# EAGLE schematic doska-digital (EAGLE 6.2)
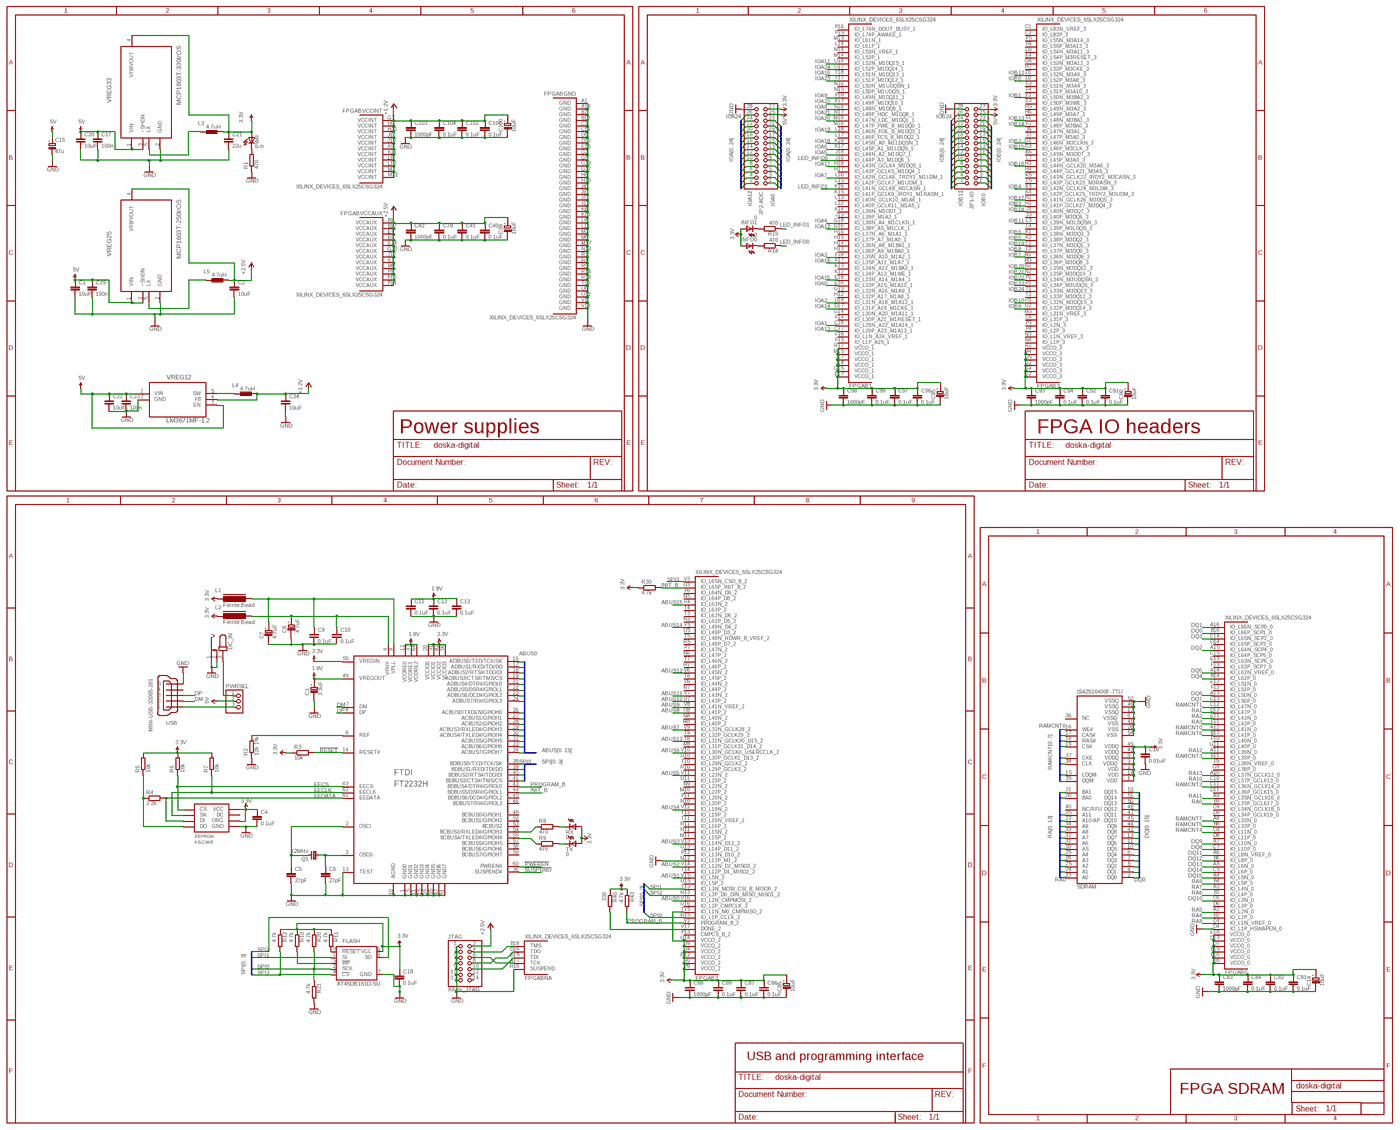
[diagram p0: schematic, sheet 1, overview]
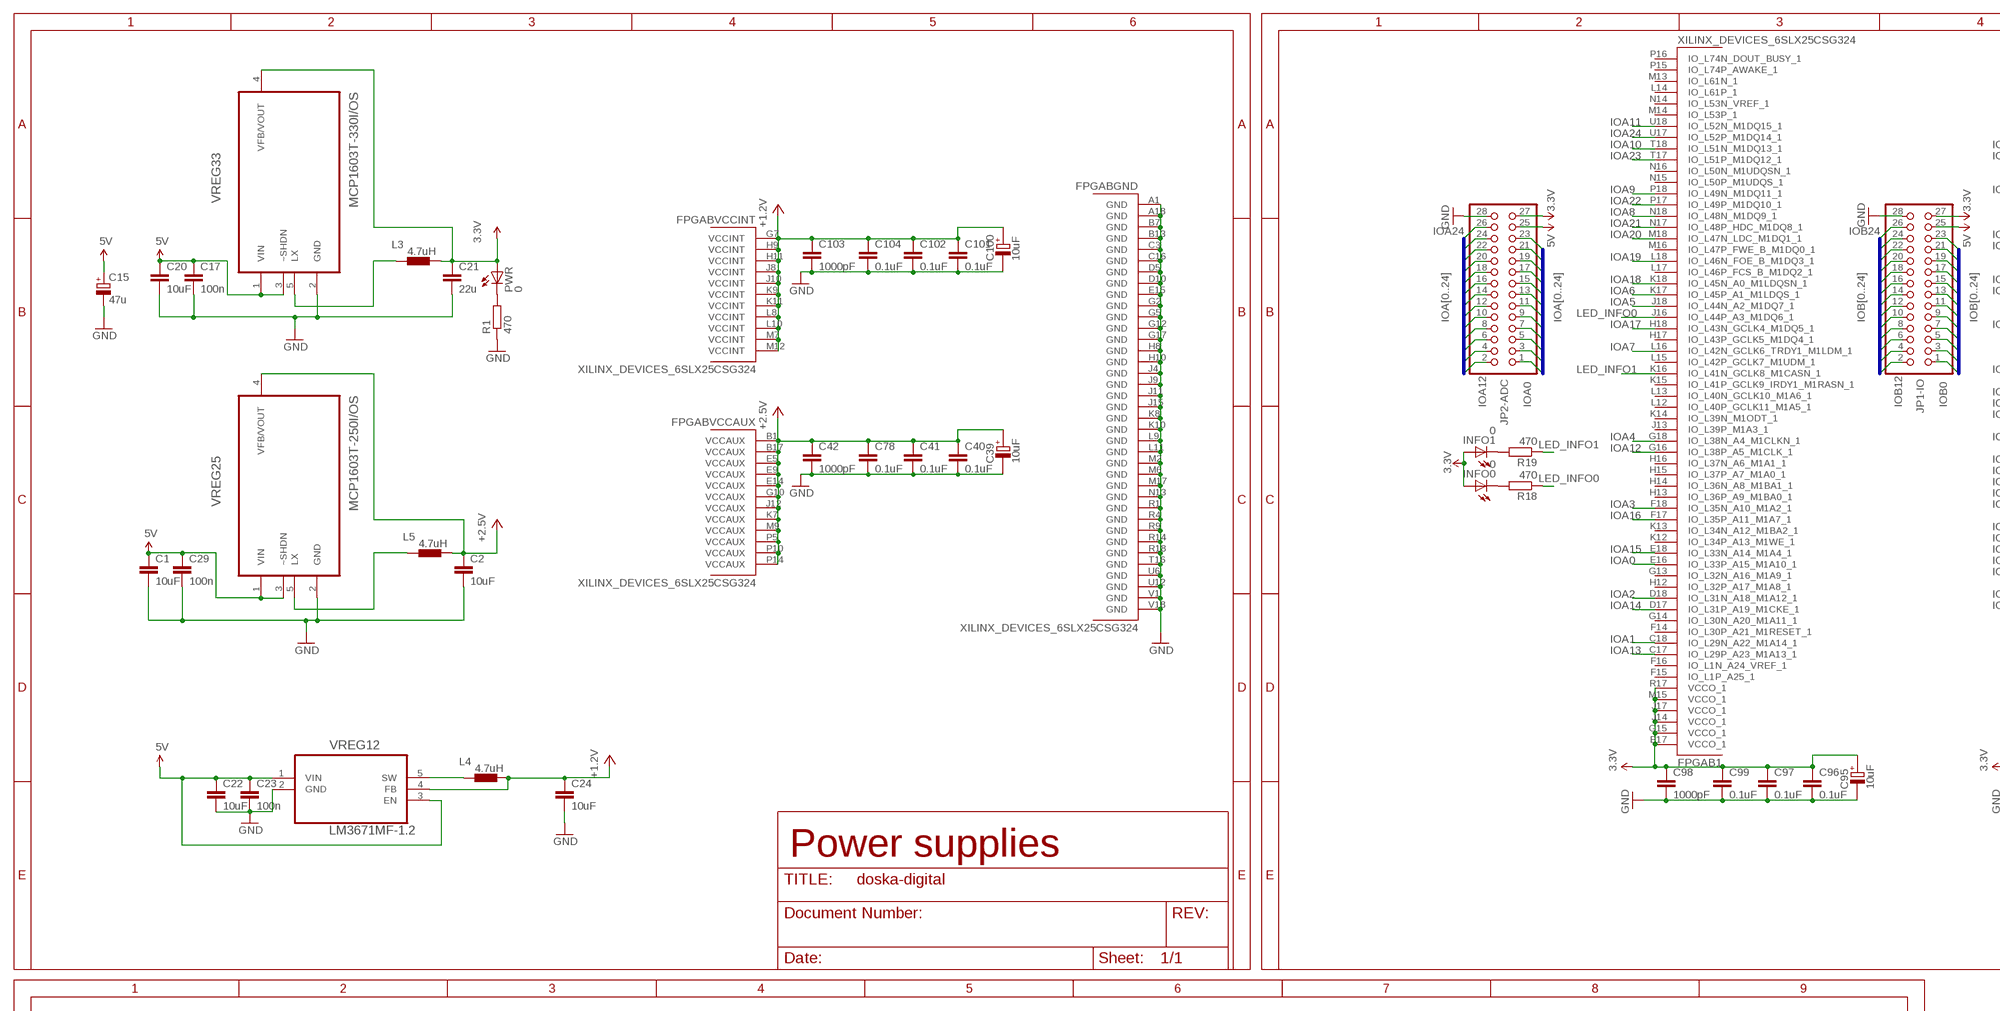
[diagram p1: schematic, sheet 1, part 1 of 4]
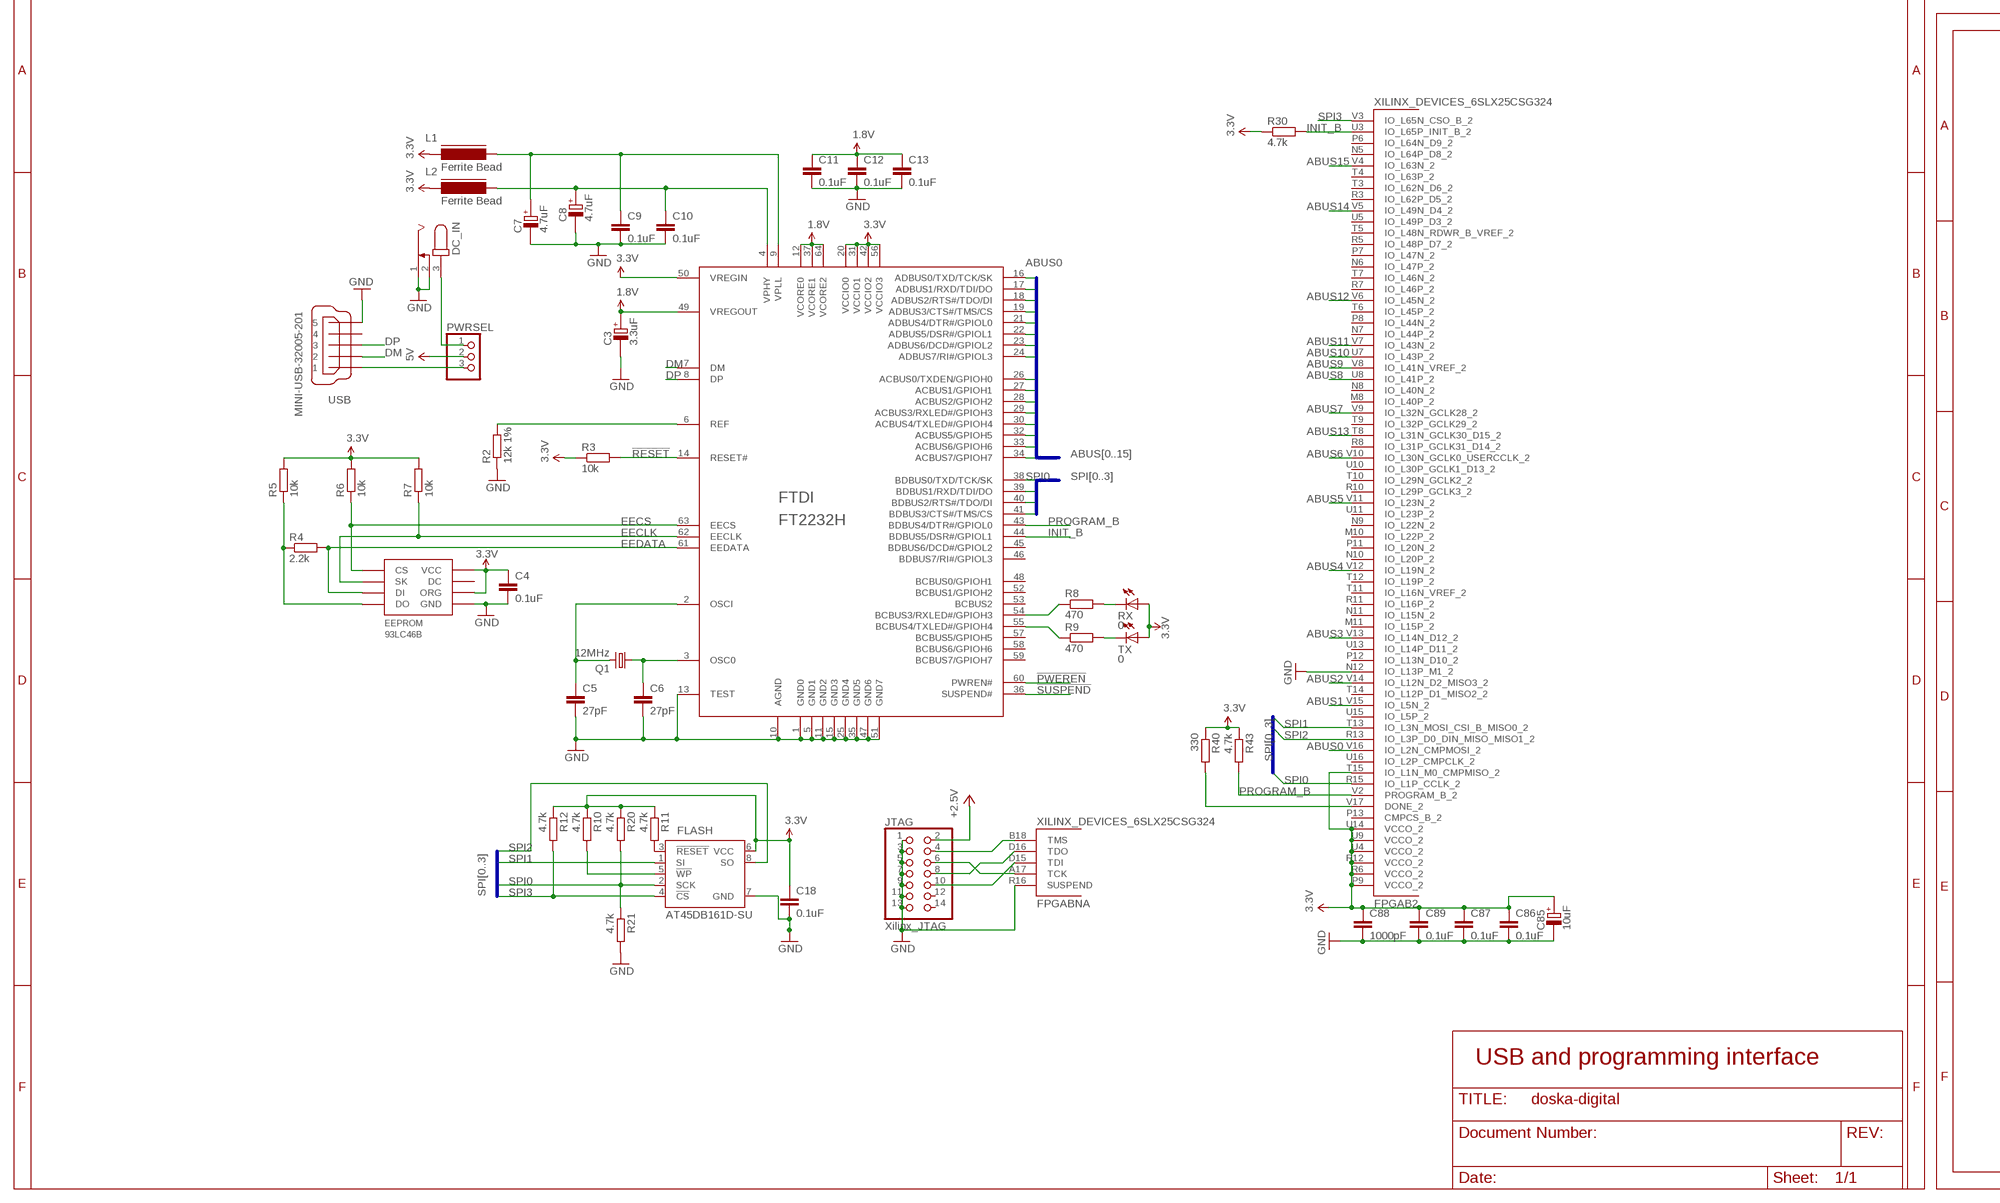
[diagram p2: schematic, sheet 1, part 2 of 4]
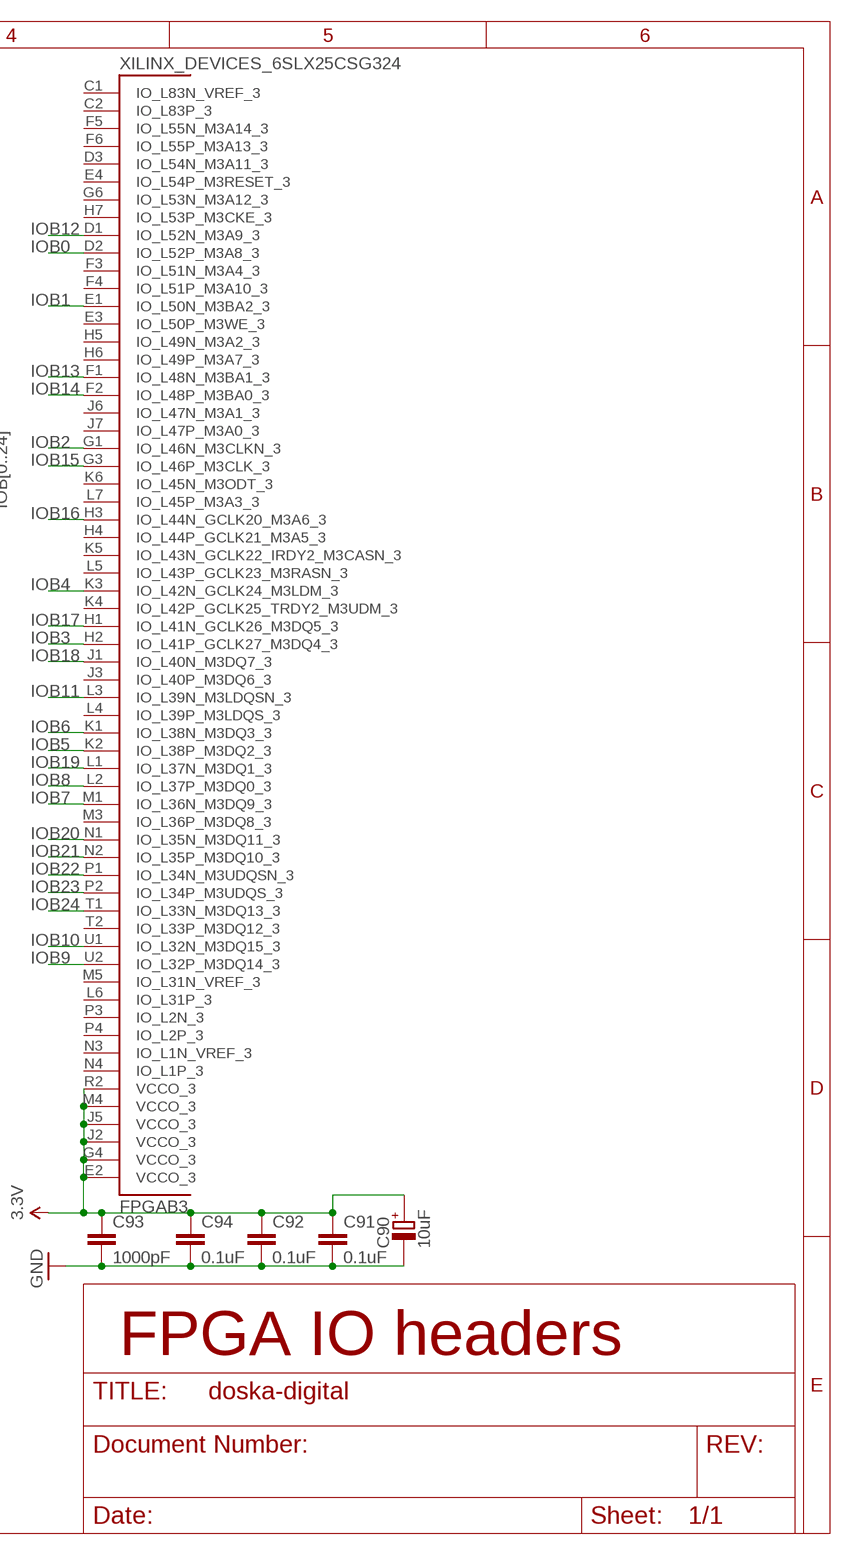
[diagram p3: schematic, sheet 1, part 3 of 4]
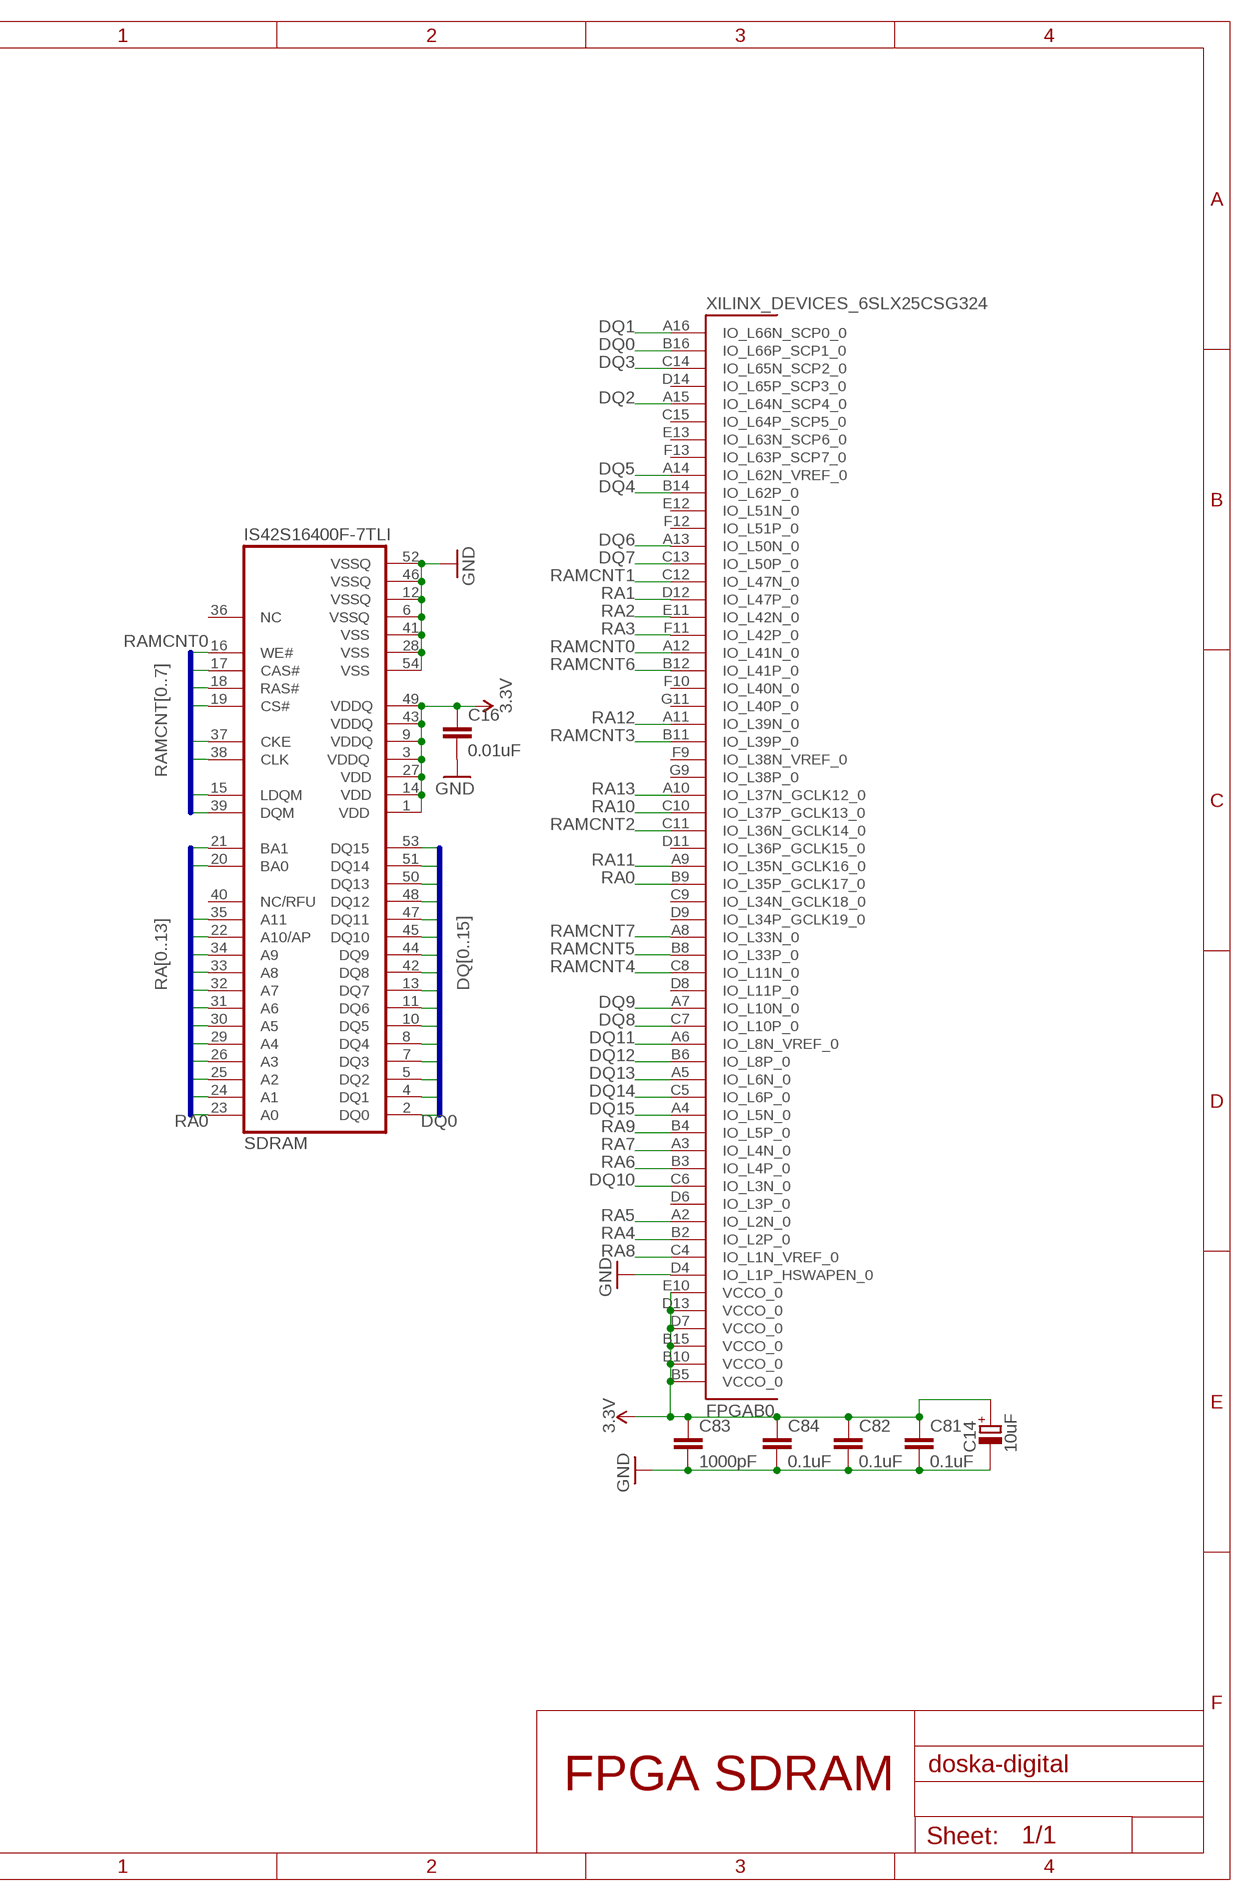
[diagram p4: schematic, sheet 1, part 4 of 4]

## Parts
C1  10uF  CAPC805  [C805]
C2  10uF  CAPC805  [C805]
C3  3.3uF  POLARISED_A_CASE  [CAPMP3216X180N]
C4  0.1uF  CAPC805  [C805]
C5  27pF  CAPC805  [C805]
C6  27pF  CAPC805  [C805]
C7  4.7uF  POLARISED_A_CASE  [CAPMP3216X180N]
C8  4.7uF  POLARISED_A_CASE  [CAPMP3216X180N]
C9  0.1uF  CAPC603  [C603]
C10  0.1uF  CAPC603  [C603]
C11  0.1uF  CAPC603  [C603]
C12  0.1uF  CAPC603  [C603]
C13  0.1uF  CAPC805  [C805]
C14  10uF  POLARISED_A_CASE  [CAPMP3216X180N]
C15  47u  RCL_CPOL-EUE2-5  [RCL_E2-5]
C16  0.01uF  CAPC805  [C805]
C17  100n  CAPC805  [C805]
C18  0.1uF  CAPC805  [C805]
C20  10uF  CAPC805  [C805]
C21  22u  CAPC805  [C805]
C22  10uF  CAPC805  [C805]
C23  100n  CAPC805  [C805]
C24  10uF  CAPC805  [C805]
C29  100n  CAPC805  [C805]
C39  10uF  POLARISED_A_CASE  [CAPMP3216X180N]
C40  0.1uF  CAPC603  [C603]
C41  0.1uF  CAPC603  [C603]
C42  1000pF  CAPC603  [C603]
C78  0.1uF  CAPC603  [C603]
C81  0.1uF  CAPC603  [C603]
C82  0.1uF  CAPC603  [C603]
C83  1000pF  CAPC603  [C603]
C84  0.1uF  CAPC603  [C603]
C85  10uF  POLARISED_A_CASE  [CAPMP3216X180N]
C86  0.1uF  CAPC603  [C603]
C87  0.1uF  CAPC603  [C603]
C88  1000pF  CAPC603  [C603]
C89  0.1uF  CAPC603  [C603]
C90  10uF  POLARISED_A_CASE  [CAPMP3216X180N]
C91  0.1uF  CAPC603  [C603]
C92  0.1uF  CAPC603  [C603]
C93  1000pF  CAPC603  [C603]
C94  0.1uF  CAPC603  [C603]
C95  10uF  POLARISED_A_CASE  [CAPMP3216X180N]
C96  0.1uF  CAPC603  [C603]
C97  0.1uF  CAPC603  [C603]
C98  1000pF  CAPC603  [C603]
C99  0.1uF  CAPC603  [C603]
C100  10uF  POLARISED_A_CASE  [CAPMP3216X180N]
C101  0.1uF  CAPC603  [C603]
C102  0.1uF  CAPC603  [C603]
C103  1000pF  CAPC603  [C603]
C104  0.1uF  CAPC603  [C603]
DC_IN  CON-JACK_JACK-PLUG1  [CON-JACK_SPC4078]
EEPROM  93LC46B  93C46  [SOIC8]
FLASH  AT45DB161D-SU  [8S2]
FPGA  XILINX_DEVICES_6SLX25CSG324  [XILINX_DEVICES_CS324]
FTDI  FT2232H  [LQFP64]
INFO0  0  LEDCHIPLED_1206  [CHIPLED_1206]
INFO1  0  LEDCHIPLED_1206  [CHIPLED_1206]
JP1-IO  PINHEAD_PINHD-2X14  [PINHEAD_2X14]
JP2-ADC  PINHEAD_PINHD-2X14  [PINHEAD_2X14]
JTAG  Xilinx_JTAG  PINHEAD_PINHD-2X7  [PINHEAD_2X07]
L1  Ferrite Bead  FERRITE_BEAD805  [FB805]
L2  Ferrite Bead  FERRITE_BEAD805  [FB805]
L3  4.7uH  SMT43-4R7K  [SMT43]
L4  4.7uH  SMT43-4R7K  [SMT43]
L5  4.7uH  SMT43-4R7K  [SMT43]
PWR  0  LEDCHIPLED_1206  [CHIPLED_1206]
PWRSEL  PINHEAD_PINHD-1X3  [PINHEAD_1X03]
Q1  12MHz  CRYSTALCTS406  [CTS406]
R1  470  RESISTORR805R805  [R805]
R2  12k 1%  RESISTORR603  [R603]
R3  10k  RESISTORR805R805  [R805]
R4  2.2k  RESISTORR805R805  [R805]
R5  10k  RESISTORR805R805  [R805]
R6  10k  RESISTORR805R805  [R805]
R7  10k  RESISTORR805R805  [R805]
R8  470  RESISTORR805R805  [R805]
R9  470  RESISTORR805R805  [R805]
R10  4.7k  RESISTORR805R805  [R805]
R11  4.7k  RESISTORR805R805  [R805]
R12  4.7k  RESISTORR805R805  [R805]
R18  470  RESISTORR805R805  [R805]
R19  470  RESISTORR805R805  [R805]
R20  4.7k  RESISTORR603  [R603]
R21  4.7k  RESISTORR603  [R603]
R30  4.7k  RESISTORR603  [R603]
R40  330  RESISTORR603  [R603]
R43  4.7k  RESISTORR603  [R603]
RX  0  LEDCHIPLED_1206  [CHIPLED_1206]
SDRAM  IS42S16400F-7TLI  AS4C4M16S-6TAN  [TSOP54]
TX  0  LEDCHIPLED_1206  [CHIPLED_1206]
USB  MINI-USB-32005-201  [32005-201]
VREG12  LM3671MF-1.2  [SOT95P284X122-5N]
VREG25  MCP1603T-250I/OS  [SOT95P280X110-5N]
VREG33  MCP1603T-330I/OS  [SOT95P280X110-5N]

## Nets
1.8V: C3.+ C11.1 C12.1 C13.1 FTDI.12(VCORE0) FTDI.37(VCORE1) FTDI.49(VREGOUT) FTDI.64(VCORE2)
3.3V: C4.1 C14.+ C16.1 C18.1 C21.1 C81.1 C82.1 C83.1 C84.1 C85.+ C86.1 C87.1 C88.1 C89.1 C90.+ C91.1 C92.1 C93.1 C94.1 C95.+ C96.1 C97.1 C98.1 C99.1 EEPROM.6(ORG) EEPROM.8(VCC) FLASH.6(VCC) FPGA.B5(B0:VCCO_0) FPGA.B10(B0:VCCO_0) FPGA.B15(B0:VCCO_0) FPGA.D7(B0:VCCO_0) FPGA.D13(B0:VCCO_0) FPGA.E2(B3:VCCO_3) FPGA.E10(B0:VCCO_0) FPGA.E17(B1:VCCO_1) FPGA.G4(B3:VCCO_3) FPGA.G15(B1:VCCO_1) FPGA.J2(B3:VCCO_3) FPGA.J5(B3:VCCO_3) FPGA.J14(B1:VCCO_1) FPGA.J17(B1:VCCO_1) FPGA.M4(B3:VCCO_3) FPGA.M15(B1:VCCO_1) FPGA.P9(B2:VCCO_2) FPGA.R2(B3:VCCO_3) FPGA.R6(B2:VCCO_2) FPGA.R12(B2:VCCO_2) FPGA.R17(B1:VCCO_1) FPGA.T15(B2:IO_L1N_M0_CMPMISO_2) FPGA.U4(B2:VCCO_2) FPGA.U9(B2:VCCO_2) FPGA.U14(B2:VCCO_2) FTDI.20(VCCIO0) FTDI.31(VCCIO1) FTDI.42(VCCIO2) FTDI.50(VREGIN) FTDI.56(VCCIO3) INFO0.A INFO1.A JP1-IO.27 JP2-ADC.27 L1.2 L2.2 L3.P$1 PWR.A R3.1 R5.2 R6.2 R7.2 R10.1 R11.1 R12.1 R20.1 R30.1 R40.1 R43.1 RX.A SDRAM.1(VDD) SDRAM.3(VDDQ) SDRAM.9(VDDQ) SDRAM.14(VDD) SDRAM.27(VDD) SDRAM.43(VDDQ) SDRAM.49(VDDQ) TX.A VREG33.4(VFB/VOUT)
5V: C1.1 C15.+ C17.1 C20.1 C22.1 C23.1 C29.1 JP1-IO.25 JP2-ADC.25 PWRSEL.2 VREG12.1(VIN) VREG12.3(EN) VREG25.1(VIN) VREG25.3(~SHDN) VREG33.1(VIN) VREG33.3(~SHDN)
!PWEREN: FTDI.60(PWREN#)
!RESET: FTDI.14(RESET#) R3.2
!SUSPEND: FTDI.36(SUSPEND#)
+1.2V: C24.1 C100.+ C101.1 C102.1 C103.1 C104.1 FPGA.G7(BVCCINT:VCCINT) FPGA.H9(BVCCINT:VCCINT) FPGA.H11(BVCCINT:VCCINT) FPGA.J8(BVCCINT:VCCINT) FPGA.J10(BVCCINT:VCCINT) FPGA.K9(BVCCINT:VCCINT) FPGA.K11(BVCCINT:VCCINT) FPGA.L8(BVCCINT:VCCINT) FPGA.L10(BVCCINT:VCCINT) FPGA.M7(BVCCINT:VCCINT) FPGA.M12(BVCCINT:VCCINT) L4.P$1 VREG12.4(FB)
+2.5V: C2.1 C39.+ C40.1 C41.1 C42.1 C78.1 FPGA.B1(BVCCAUX:VCCAUX) FPGA.B17(BVCCAUX:VCCAUX) FPGA.E5(BVCCAUX:VCCAUX) FPGA.E9(BVCCAUX:VCCAUX) FPGA.E14(BVCCAUX:VCCAUX) FPGA.G10(BVCCAUX:VCCAUX) FPGA.J12(BVCCAUX:VCCAUX) FPGA.K7(BVCCAUX:VCCAUX) FPGA.M9(BVCCAUX:VCCAUX) FPGA.P5(BVCCAUX:VCCAUX) FPGA.P10(BVCCAUX:VCCAUX) FPGA.P14(BVCCAUX:VCCAUX) JTAG.2 L5.P$1 VREG25.4(VFB/VOUT)
ABUS0: FPGA.V16(B2:IO_L2N_CMPMOSI_2) FTDI.16(ADBUS0/TXD/TCK/SK)
ABUS1: FPGA.V15(B2:IO_L5N_2) FTDI.17(ADBUS1/RXD/TDI/DO)
ABUS2: FPGA.V14(B2:IO_L12N_D2_MISO3_2) FTDI.18(ADBUS2/RTS#/TDO/DI)
ABUS3: FPGA.V13(B2:IO_L14N_D12_2) FTDI.19(ADBUS3/CTS#/TMS/CS)
ABUS4: FPGA.V12(B2:IO_L19N_2) FTDI.21(ADBUS4/DTR#/GPIOL0)
ABUS5: FPGA.V11(B2:IO_L23N_2) FTDI.22(ADBUS5/DSR#/GPIOL1)
ABUS6: FPGA.V10(B2:IO_L30N_GCLK0_USERCCLK_2) FTDI.23(ADBUS6/DCD#/GPIOL2)
ABUS7: FPGA.V9(B2:IO_L32N_GCLK28_2) FTDI.24(ADBUS7/RI#/GPIOL3)
ABUS8: FPGA.U8(B2:IO_L41P_2) FTDI.26(ACBUS0/TXDEN/GPIOH0)
ABUS9: FPGA.V8(B2:IO_L41N_VREF_2) FTDI.27(ACBUS1/GPIOH1)
ABUS10: FPGA.U7(B2:IO_L43P_2) FTDI.28(ACBUS2/GPIOH2)
ABUS11: FPGA.V7(B2:IO_L43N_2) FTDI.29(ACBUS3/RXLED#/GPIOH3)
ABUS12: FPGA.V6(B2:IO_L45N_2) FTDI.30(ACBUS4/TXLED#/GPIOH4)
ABUS13: FPGA.T8(B2:IO_L31N_GCLK30_D15_2) FTDI.32(ACBUS5/GPIOH5)
ABUS14: FPGA.V5(B2:IO_L49N_D4_2) FTDI.33(ACBUS6/GPIOH6)
ABUS15: FPGA.V4(B2:IO_L63N_2) FTDI.34(ACBUS7/GPIOH7)
DM: FTDI.7(DM) USB.2
DP: FTDI.8(DP) USB.3
DQ0: FPGA.B16(B0:IO_L66P_SCP1_0) SDRAM.2(DQ0)
DQ1: FPGA.A16(B0:IO_L66N_SCP0_0) SDRAM.4(DQ1)
DQ2: FPGA.A15(B0:IO_L64N_SCP4_0) SDRAM.5(DQ2)
DQ3: FPGA.C14(B0:IO_L65N_SCP2_0) SDRAM.7(DQ3)
DQ4: FPGA.B14(B0:IO_L62P_0) SDRAM.8(DQ4)
DQ5: FPGA.A14(B0:IO_L62N_VREF_0) SDRAM.10(DQ5)
DQ6: FPGA.A13(B0:IO_L50N_0) SDRAM.11(DQ6)
DQ7: FPGA.C13(B0:IO_L50P_0) SDRAM.13(DQ7)
DQ8: FPGA.C7(B0:IO_L10P_0) SDRAM.42(DQ8)
DQ9: FPGA.A7(B0:IO_L10N_0) SDRAM.44(DQ9)
DQ10: FPGA.C6(B0:IO_L3N_0) SDRAM.45(DQ10)
DQ11: FPGA.A6(B0:IO_L8N_VREF_0) SDRAM.47(DQ11)
DQ12: FPGA.B6(B0:IO_L8P_0) SDRAM.48(DQ12)
DQ13: FPGA.A5(B0:IO_L6N_0) SDRAM.50(DQ13)
DQ14: FPGA.C5(B0:IO_L6P_0) SDRAM.51(DQ14)
DQ15: FPGA.A4(B0:IO_L5N_0) SDRAM.53(DQ15)
EECLK: EEPROM.2(SK) FTDI.62(EECLK) R7.1
EECS: EEPROM.1(CS) FTDI.63(EECS) R6.1
EEDATA: EEPROM.3(DI) FTDI.61(EEDATA) R4.2
GND: C1.2 C2.2 C3.- C4.2 C5.2 C6.2 C7.- C8.- C9.2 C10.2 C11.2 C12.2 C13.2 C14.- C15.- C16.2 C17.2 C18.2 C20.2 C21.2 C22.2 C23.2 C24.2 C29.2 C39.- C40.2 C41.2 C42.2 C78.2 C81.2 C82.2 C83.2 C84.2 C85.- C86.2 C87.2 C88.2 C89.2 C90.- C91.2 C92.2 C93.2 C94.2 C95.- C96.2 C97.2 C98.2 C99.2 C100.- C101.2 C102.2 C103.2 C104.2 DC_IN.1 DC_IN.2 EEPROM.5(GND) FLASH.7(GND) FPGA.A1(BGND:GND) FPGA.A18(BGND:GND) FPGA.B7(BGND:GND) FPGA.B13(BGND:GND) FPGA.C3(BGND:GND) FPGA.C16(BGND:GND) FPGA.D4(B0:IO_L1P_HSWAPEN_0) FPGA.D5(BGND:GND) FPGA.D10(BGND:GND) FPGA.E15(BGND:GND) FPGA.G2(BGND:GND) FPGA.G5(BGND:GND) FPGA.G12(BGND:GND) FPGA.G17(BGND:GND) FPGA.H8(BGND:GND) FPGA.H10(BGND:GND) FPGA.J4(BGND:GND) FPGA.J9(BGND:GND) FPGA.J11(BGND:GND) FPGA.J15(BGND:GND) FPGA.K8(BGND:GND) FPGA.K10(BGND:GND) FPGA.L9(BGND:GND) FPGA.L11(BGND:GND) FPGA.M2(BGND:GND) FPGA.M6(BGND:GND) FPGA.M17(BGND:GND) FPGA.N12(B2:IO_L13P_M1_2) FPGA.N13(BGND:GND) FPGA.R1(BGND:GND) FPGA.R4(BGND:GND) FPGA.R9(BGND:GND) FPGA.R14(BGND:GND) FPGA.R16(BNA:SUSPEND) FPGA.R18(BGND:GND) FPGA.T16(BGND:GND) FPGA.U6(BGND:GND) FPGA.U12(BGND:GND) FPGA.V1(BGND:GND) FPGA.V18(BGND:GND) FTDI.1(GND0) FTDI.5(GND1) FTDI.10(AGND) FTDI.11(GND2) FTDI.13(TEST) FTDI.15(GND3) FTDI.25(GND4) FTDI.35(GND5) FTDI.47(GND6) FTDI.51(GND7) JP1-IO.28 JP2-ADC.28 JTAG.1 JTAG.3 JTAG.5 JTAG.7 JTAG.9 JTAG.11 JTAG.13 R1.1 R2.1 R21.2 SDRAM.6(VSSQ) SDRAM.12(VSSQ) SDRAM.28(VSS) SDRAM.41(VSS) SDRAM.46(VSSQ) SDRAM.52(VSSQ) SDRAM.54(VSS) USB.5 VREG12.2(GND) VREG25.2(GND) VREG33.2(GND)
INIT_B: FPGA.U3(B2:IO_L65P_INIT_B_2) FTDI.44(BDBUS5/DSR#/GPIOL1) R30.2
IOA0: FPGA.E16(B1:IO_L33P_A15_M1A10_1) JP2-ADC.1
IOA1: FPGA.C18(B1:IO_L29N_A22_M1A14_1) JP2-ADC.3
IOA2: FPGA.D18(B1:IO_L31N_A18_M1A12_1) JP2-ADC.5
IOA3: FPGA.F18(B1:IO_L35N_A10_M1A2_1) JP2-ADC.7
IOA4: FPGA.G18(B1:IO_L38N_A4_M1CLKN_1) JP2-ADC.9
IOA5: FPGA.J18(B1:IO_L44N_A2_M1DQ7_1) JP2-ADC.11
IOA6: FPGA.K17(B1:IO_L45P_A1_M1LDQS_1) JP2-ADC.13
IOA7: FPGA.L16(B1:IO_L42N_GCLK6_TRDY1_M1LDM_1) JP2-ADC.15
IOA8: FPGA.N18(B1:IO_L48N_M1DQ9_1) JP2-ADC.17
IOA9: FPGA.P18(B1:IO_L49N_M1DQ11_1) JP2-ADC.19
IOA10: FPGA.T18(B1:IO_L51N_M1DQ13_1) JP2-ADC.21
IOA11: FPGA.U18(B1:IO_L52N_M1DQ15_1) JP2-ADC.23
IOA12: FPGA.G16(B1:IO_L38P_A5_M1CLK_1) JP2-ADC.2
IOA13: FPGA.C17(B1:IO_L29P_A23_M1A13_1) JP2-ADC.4
IOA14: FPGA.D17(B1:IO_L31P_A19_M1CKE_1) JP2-ADC.6
IOA15: FPGA.E18(B1:IO_L33N_A14_M1A4_1) JP2-ADC.8
IOA16: FPGA.F17(B1:IO_L35P_A11_M1A7_1) JP2-ADC.10
IOA17: FPGA.H18(B1:IO_L43N_GCLK4_M1DQ5_1) JP2-ADC.12
IOA18: FPGA.K18(B1:IO_L45N_A0_M1LDQSN_1) JP2-ADC.14
IOA19: FPGA.L18(B1:IO_L46N_FOE_B_M1DQ3_1) JP2-ADC.16
IOA20: FPGA.M18(B1:IO_L47N_LDC_M1DQ1_1) JP2-ADC.18
IOA21: FPGA.N17(B1:IO_L48P_HDC_M1DQ8_1) JP2-ADC.20
IOA22: FPGA.P17(B1:IO_L49P_M1DQ10_1) JP2-ADC.22
IOA23: FPGA.T17(B1:IO_L51P_M1DQ12_1) JP2-ADC.24
IOA24: FPGA.U17(B1:IO_L52P_M1DQ14_1) JP2-ADC.26
IOB0: FPGA.D2(B3:IO_L52P_M3A8_3) JP1-IO.1
IOB1: FPGA.E1(B3:IO_L50N_M3BA2_3) JP1-IO.3
IOB2: FPGA.G1(B3:IO_L46N_M3CLKN_3) JP1-IO.5
IOB3: FPGA.H2(B3:IO_L41P_GCLK27_M3DQ4_3) JP1-IO.7
IOB4: FPGA.K3(B3:IO_L42N_GCLK24_M3LDM_3) JP1-IO.9
IOB5: FPGA.K2(B3:IO_L38P_M3DQ2_3) JP1-IO.11
IOB6: FPGA.K1(B3:IO_L38N_M3DQ3_3) JP1-IO.13
IOB7: FPGA.M1(B3:IO_L36N_M3DQ9_3) JP1-IO.15
IOB8: FPGA.L2(B3:IO_L37P_M3DQ0_3) JP1-IO.17
IOB9: FPGA.U2(B3:IO_L32P_M3DQ14_3) JP1-IO.19
IOB10: FPGA.U1(B3:IO_L32N_M3DQ15_3) JP1-IO.21
IOB11: FPGA.L3(B3:IO_L39N_M3LDQSN_3) JP1-IO.23
IOB12: FPGA.D1(B3:IO_L52N_M3A9_3) JP1-IO.2
IOB13: FPGA.F1(B3:IO_L48N_M3BA1_3) JP1-IO.4
IOB14: FPGA.F2(B3:IO_L48P_M3BA0_3) JP1-IO.6
IOB15: FPGA.G3(B3:IO_L46P_M3CLK_3) JP1-IO.8
IOB16: FPGA.H3(B3:IO_L44N_GCLK20_M3A6_3) JP1-IO.10
IOB17: FPGA.H1(B3:IO_L41N_GCLK26_M3DQ5_3) JP1-IO.12
IOB18: FPGA.J1(B3:IO_L40N_M3DQ7_3) JP1-IO.14
IOB19: FPGA.L1(B3:IO_L37N_M3DQ1_3) JP1-IO.16
IOB20: FPGA.N1(B3:IO_L35N_M3DQ11_3) JP1-IO.18
IOB21: FPGA.N2(B3:IO_L35P_M3DQ10_3) JP1-IO.20
IOB22: FPGA.P1(B3:IO_L34N_M3UDQSN_3) JP1-IO.22
IOB23: FPGA.P2(B3:IO_L34P_M3UDQS_3) JP1-IO.24
IOB24: FPGA.T1(B3:IO_L33N_M3DQ13_3) JP1-IO.26
LED_INFO0: FPGA.J16(B1:IO_L44P_A3_M1DQ6_1) R18.1
LED_INFO1: FPGA.K16(B1:IO_L41N_GCLK8_M1CASN_1) R19.1
N$1: PWR.C R1.2
N$2: R8.2 RX.C
N$3: R9.2 TX.C
N$4: FTDI.6(REF) R2.2
N$5: FLASH.5(!WP) R10.2
N$7: FLASH.3(!RESET) R11.2
N$9: C5.1 FTDI.2(OSCI) Q1.3
N$10: C6.1 FTDI.3(OSC0) Q1.1
N$11: L4.P$2 VREG12.5(SW)
N$12: INFO0.C R18.2
N$13: L5.P$2 VREG25.5(LX)
N$14: PWRSEL.3 USB.1
N$15: L3.P$2 VREG33.5(LX)
N$18: DC_IN.3 PWRSEL.1
N$22: INFO1.C R19.2
N$25: FTDI.55(BCBUS4/TXLED#/GPIOH4) R9.1
N$29: FTDI.54(BCBUS3/RXLED#/GPIOH3) R8.1
N$40: FPGA.V17(B2:DONE_2) R40.2
N$43: FPGA.B18(BNA:TMS) JTAG.4
N$44: FPGA.A17(BNA:TCK) JTAG.6
N$45: EEPROM.4(DO) R4.1 R5.1
N$46: FPGA.D16(BNA:TDO) JTAG.8
N$47: FPGA.D15(BNA:TDI) JTAG.10
N$49: C7.+ C9.1 FTDI.9(VPLL) L1.1
N$481: C8.+ C10.1 FTDI.4(VPHY) L2.1
PROGRAM_B: FPGA.V2(B2:PROGRAM_B_2) FTDI.43(BDBUS4/DTR#/GPIOL0) R43.2
RA0: FPGA.B9(B0:IO_L35P_GCLK17_0) SDRAM.23(A0)
RA1: FPGA.D12(B0:IO_L47P_0) SDRAM.24(A1)
RA2: FPGA.E11(B0:IO_L42N_0) SDRAM.25(A2)
RA3: FPGA.F11(B0:IO_L42P_0) SDRAM.26(A3)
RA4: FPGA.B2(B0:IO_L2P_0) SDRAM.29(A4)
RA5: FPGA.A2(B0:IO_L2N_0) SDRAM.30(A5)
RA6: FPGA.B3(B0:IO_L4P_0) SDRAM.31(A6)
RA7: FPGA.A3(B0:IO_L4N_0) SDRAM.32(A7)
RA8: FPGA.C4(B0:IO_L1N_VREF_0) SDRAM.33(A8)
RA9: FPGA.B4(B0:IO_L5P_0) SDRAM.34(A9)
RA10: FPGA.C10(B0:IO_L37P_GCLK13_0) SDRAM.22(A10/AP)
RA11: FPGA.A9(B0:IO_L35N_GCLK16_0) SDRAM.35(A11)
RA12: FPGA.A11(B0:IO_L39N_0) SDRAM.20(BA0)
RA13: FPGA.A10(B0:IO_L37N_GCLK12_0) SDRAM.21(BA1)
RAMCNT0: FPGA.A12(B0:IO_L41N_0) SDRAM.16(WE#)
RAMCNT1: FPGA.C12(B0:IO_L47N_0) SDRAM.17(CAS#)
RAMCNT2: FPGA.C11(B0:IO_L36N_GCLK14_0) SDRAM.18(RAS#)
RAMCNT3: FPGA.B11(B0:IO_L39P_0) SDRAM.19(CS#)
RAMCNT4: FPGA.C8(B0:IO_L11N_0) SDRAM.37(CKE)
RAMCNT5: FPGA.B8(B0:IO_L33P_0) SDRAM.38(CLK)
RAMCNT6: FPGA.B12(B0:IO_L41P_0) SDRAM.15(LDQM)
RAMCNT7: FPGA.A8(B0:IO_L33N_0) SDRAM.39(DQM)
SPI0: FLASH.2(SCK) FPGA.R15(B2:IO_L1P_CCLK_2) FTDI.38(BDBUS0/TXD/TCK/SK) R20.2 R21.1
SPI1: FLASH.1(SI) FPGA.T13(B2:IO_L3N_MOSI_CSI_B_MISO0_2) FTDI.39(BDBUS1/RXD/TDI/DO)
SPI2: FLASH.8(SO) FPGA.R13(B2:IO_L3P_D0_DIN_MISO_MISO1_2) FTDI.40(BDBUS2/RTS#/TDO/DI)
SPI3: FLASH.4(!CS) FPGA.V3(B2:IO_L65N_CSO_B_2) FTDI.41(BDBUS3/CTS#/TMS/CS) R12.2
Unconnected: EEPROM.7(DC) FPGA.C1(B3:IO_L83N_VREF_3) FPGA.C2(B3:IO_L83P_3) FPGA.C9(B0:IO_L34N_GCLK18_0) FPGA.C15(B0:IO_L64P_SCP5_0) FPGA.D3(B3:IO_L54N_M3A11_3) FPGA.D6(B0:IO_L3P_0) FPGA.D8(B0:IO_L11P_0) FPGA.D9(B0:IO_L34P_GCLK19_0) FPGA.D11(B0:IO_L36P_GCLK15_0) FPGA.D14(B0:IO_L65P_SCP3_0) FPGA.E3(B3:IO_L50P_M3WE_3) FPGA.E4(B3:IO_L54P_M3RESET_3) FPGA.E6(BNOCONN:NC) FPGA.E7(BNOCONN:NC) FPGA.E8(BNOCONN:NC) FPGA.E12(B0:IO_L51N_0) FPGA.E13(B0:IO_L63N_SCP6_0) FPGA.F3(B3:IO_L51N_M3A4_3) FPGA.F4(B3:IO_L51P_M3A10_3) FPGA.F5(B3:IO_L55N_M3A14_3) FPGA.F6(B3:IO_L55P_M3A13_3) FPGA.F7(BNOCONN:NC) FPGA.F8(BNOCONN:NC) FPGA.F9(B0:IO_L38N_VREF_0) FPGA.F10(B0:IO_L40N_0) FPGA.F12(B0:IO_L51P_0) FPGA.F13(B0:IO_L63P_SCP7_0) FPGA.F14(B1:IO_L30P_A21_M1RESET_1) FPGA.F15(B1:IO_L1P_A25_1) FPGA.F16(B1:IO_L1N_A24_VREF_1) FPGA.G6(B3:IO_L53N_M3A12_3) FPGA.G8(BNOCONN:NC) FPGA.G9(B0:IO_L38P_0) FPGA.G11(B0:IO_L40P_0) FPGA.G13(B1:IO_L32N_A16_M1A9_1) FPGA.G14(B1:IO_L30N_A20_M1A11_1) FPGA.H4(B3:IO_L44P_GCLK21_M3A5_3) FPGA.H5(B3:IO_L49N_M3A2_3) FPGA.H6(B3:IO_L49P_M3A7_3) FPGA.H7(B3:IO_L53P_M3CKE_3) FPGA.H12(B1:IO_L32P_A17_M1A8_1) FPGA.H13(B1:IO_L36P_A9_M1BA0_1) FPGA.H14(B1:IO_L36N_A8_M1BA1_1) FPGA.H15(B1:IO_L37P_A7_M1A0_1) FPGA.H16(B1:IO_L37N_A6_M1A1_1) FPGA.H17(B1:IO_L43P_GCLK5_M1DQ4_1) FPGA.J3(B3:IO_L40P_M3DQ6_3) FPGA.J6(B3:IO_L47N_M3A1_3) FPGA.J7(B3:IO_L47P_M3A0_3) FPGA.J13(B1:IO_L39P_M1A3_1) FPGA.K4(B3:IO_L42P_GCLK25_TRDY2_M3UDM_3) FPGA.K5(B3:IO_L43N_GCLK22_IRDY2_M3CASN_3) FPGA.K6(B3:IO_L45N_M3ODT_3) FPGA.K12(B1:IO_L34P_A13_M1WE_1) FPGA.K13(B1:IO_L34N_A12_M1BA2_1) FPGA.K14(B1:IO_L39N_M1ODT_1) FPGA.K15(B1:IO_L41P_GCLK9_IRDY1_M1RASN_1) FPGA.L4(B3:IO_L39P_M3LDQS_3) FPGA.L5(B3:IO_L43P_GCLK23_M3RASN_3) FPGA.L6(B3:IO_L31P_3) FPGA.L7(B3:IO_L45P_M3A3_3) FPGA.L12(B1:IO_L40P_GCLK11_M1A5_1) FPGA.L13(B1:IO_L40N_GCLK10_M1A6_1) FPGA.L14(B1:IO_L61P_1) FPGA.L15(B1:IO_L42P_GCLK7_M1UDM_1) FPGA.L17(B1:IO_L46P_FCS_B_M1DQ2_1) FPGA.M3(B3:IO_L36P_M3DQ8_3) FPGA.M5(B3:IO_L31N_VREF_3) FPGA.M8(B2:IO_L40P_2) FPGA.M10(B2:IO_L22P_2) FPGA.M11(B2:IO_L15P_2) FPGA.M13(B1:IO_L61N_1) FPGA.M14(B1:IO_L53P_1) FPGA.M16(B1:IO_L47P_FWE_B_M1DQ0_1) FPGA.N3(B3:IO_L1N_VREF_3) FPGA.N4(B3:IO_L1P_3) FPGA.N5(B2:IO_L64P_D8_2) FPGA.N6(B2:IO_L47P_2) FPGA.N7(B2:IO_L44P_2) FPGA.N8(B2:IO_L40N_2) FPGA.N9(B2:IO_L22N_2) FPGA.N10(B2:IO_L20P_2) FPGA.N11(B2:IO_L15N_2) FPGA.N14(B1:IO_L53N_VREF_1) FPGA.N15(B1:IO_L50P_M1UDQS_1) FPGA.N16(B1:IO_L50N_M1UDQSN_1) FPGA.P3(B3:IO_L2N_3) FPGA.P4(B3:IO_L2P_3) FPGA.P6(B2:IO_L64N_D9_2) FPGA.P7(B2:IO_L47N_2) FPGA.P8(B2:IO_L44N_2) FPGA.P11(B2:IO_L20N_2) FPGA.P12(B2:IO_L13N_D10_2) FPGA.P13(B2:CMPCS_B_2) FPGA.P15(B1:IO_L74P_AWAKE_1) FPGA.P16(B1:IO_L74N_DOUT_BUSY_1) FPGA.R3(B2:IO_L62P_D5_2) FPGA.R5(B2:IO_L48P_D7_2) FPGA.R7(B2:IO_L46P_2) FPGA.R8(B2:IO_L31P_GCLK31_D14_2) FPGA.R10(B2:IO_L29P_GCLK3_2) FPGA.R11(B2:IO_L16P_2) FPGA.T2(B3:IO_L33P_M3DQ12_3) FPGA.T3(B2:IO_L62N_D6_2) FPGA.T4(B2:IO_L63P_2) FPGA.T5(B2:IO_L48N_RDWR_B_VREF_2) FPGA.T6(B2:IO_L45P_2) FPGA.T7(B2:IO_L46N_2) FPGA.T9(B2:IO_L32P_GCLK29_2) FPGA.T10(B2:IO_L29N_GCLK2_2) FPGA.T11(B2:IO_L16N_VREF_2) FPGA.T12(B2:IO_L19P_2) FPGA.T14(B2:IO_L12P_D1_MISO2_2) FPGA.U5(B2:IO_L49P_D3_2) FPGA.U10(B2:IO_L30P_GCLK1_D13_2) FPGA.U11(B2:IO_L23P_2) FPGA.U13(B2:IO_L14P_D11_2) FPGA.U15(B2:IO_L5P_2) FPGA.U16(B2:IO_L2P_CMPCLK_2) FTDI.45(BDBUS6/DCD#/GPIOL2) FTDI.46(BDBUS7/RI#/GPIOL3) FTDI.48(BCBUS0/GPIOH1) FTDI.52(BCBUS1/GPIOH2) FTDI.53(BCBUS2) FTDI.57(BCBUS5/GPIOH5) FTDI.58(BCBUS6/GPIOH6) FTDI.59(BCBUS7/GPIOH7) JTAG.12 JTAG.14 SDRAM.36(NC) SDRAM.40(NC/RFU) USB.4

## Buses
DQ[0..15]
RAMCNT[0..7]
RA[0..13]
SPI[0..3]
ABUS[0..15]
IOA[0..24]
IOB[0..24]

## Notes on the sheet
- Power supplies | FPGA IO headers
- USB and programming interface
- FPGA SDRAM

## Library data of the parts
C1 C2 C4-C6 C9-C13 C16-C18 C20-C24 C29 C40-C42 C78 C81-C84 C86-C89 C91-C94 C96-C99 C101-C104 = dp_devices:CAP
C3 C7 C8 C14 C39 C85 C90 C95 C100 = ipc-7351-capacitor:POLARISED_
C15 = doska-digital:RCL_CPOL-EU: POLARIZED CAPACITOR, European symbol
DC_IN = doska-digital:CON-JACK_JACK-PLUG: DC POWER JACK Power Jack, DC, Right Angle, Through Hole, Rated 5A at 16VDC, PC Terminals Distributor: Farnell (www.Farnell.de) Drawing: 84N1161.pdf / 84N1162.pdf Manufacturer: SPC Technology (www.spctechnology.com) Type: SPC4077 / SPC 4078; OC_FARNELL: unknown; OC_NEWARK: unknown
EEPROM = dp_devices:93C46; 93C46: 93C46
FLASH = atmel:AT45DB161D: 16-megabit 2.5V or 2.7V DataFlash Source: http://www.atmel.com/dyn/resources/prod_documents/doc3500.pdf; MF: ATMEL; MPN: AT45DB161D-SU; OC_FARNELL: 1455040
FPGA = 6SLX25CSG324:XILINX_DEVICES_6SLX25CSG324: Xilinx FPGA: 6SLX25CSG324
FTDI = DP-EagleLibrary:FT2232H: DUAL HIGH SPEED USB TO MULTIPURPOSE UART/FIFO IC
INFO0 INFO1 PWR RX TX = led:LED: LED OSRAM: - CHIPLED LG R971, LG N971, LY N971, LG Q971, LY Q971, LO R971, LY R971 LH N974, LH R974 LS Q976, LO Q976, LY Q976 LO Q996 - Hyper CHIPLED LW Q18S LB Q993, LB Q99A, LB R99A - SideLED LS A670, LO A670, LY A670, LG A670, LP A670 LB A673, LV A673, LT A673, LW A673 LH A674 LY A675 LS A676, LA A676, LO A676, LY A676, LW A676 LS A679, LY A679, LG A679 - Hyper Micro SIDELED® LS Y876, LA Y876, LO Y876, LY Y876 LT Y87S - SmartLED LW L88C, LW L88S LB L89C, LB L89S, LG L890 LS L89K, LO L89K, LY L89K LS L896, LA L896, LO L896, LY L896 - TOPLED LS T670, LO T670, LY T670, LG T670, LP T670 LSG T670, LSP T670, LSY T670, LOP T670, LYG T670 LG T671, LOG T671, LSG T671 LB T673, LV T673, LT T673, LW T673 LH T674 LS T676, LA T676, LO T676, LY T676, LB T676, LH T676, LSB T676, LW T676 LB T67C, LV T67C, LT T67C, LS T67K, LO T67K, LY T67K, LW E67C LS E67B, LA E67B, LO E67B, LY E67B, LB E67C, LV E67C, LT E67C LW T67C LS T679, LY T679, LG T679 LS T770, LO T770, LY T770, LG T770, LP T770 LB T773, LV T773, LT T773, LW T773 LH T774 LS E675, LA E675, LY E675, LS T675 LS T776, LA T776, LO T776, LY T776, LB T776 LHGB T686 LT T68C, LB T68C - Hyper Mini TOPLED® LB M676 - Mini TOPLED Santana® LG M470 LS M47K, LO M47K, LY M47K Source: http://www.osram.convergy.de LUXEON: - LUMILED® LXK2-PW12-R00, LXK2-PW12-S00, LXK2-PW14-U00, LXK2-PW14-V00 LXK2-PM12-R00, LXK2-PM12-S00, LXK2-PM14-U00 LXK2-PE12-Q00, LXK2-PE12-R00, LXK2-PE12-S00, LXK2-PE14-T00, LXK2-PE14-U00 LXK2-PB12-K00, LXK2-PB12-L00, LXK2-PB12-M00, LXK2-PB14-N00, LXK2-PB14-P00, LXK2-PB14-Q00 LXK2-PR12-L00, LXK2-PR12-M00, LXK2-PR14-Q00, LXK2-PR14-R00 LXK2-PD12-Q00, LXK2-PD12-R00, LXK2-PD12-S00 LXK2-PH12-R00, LXK2-PH12-S00 LXK2-PL12-P00, LXK2-PL12-Q00, LXK2-PL12-R00 Source: www.luxeon.com KINGBRIGHT: KA-3528ASYC Source: www.kingbright.com
JP1-IO JP2-ADC = doska-digital:PINHEAD_PINHD-2X14: PIN HEADER
JTAG = doska-digital:PINHEAD_PINHD-2X7: PIN HEADER
L1 L2 = dp_devices:FERRITE_BEAD
L3-L5 = inductors:SMT43-4R7K
PWRSEL = doska-digital:PINHEAD_PINHD-1X3: PIN HEADER
Q1 = crystal:CRYSTAL: CRYSTAL; OC_FARNELL: unknown; OC_NEWARK: unknown
R1-R12 R18-R21 R30 R40 R43 = dp_devices:RESISTOR
SDRAM = sdram:AS4C4M16S-6TAN
USB = con-cypressindustries:MINI-USB-: MINI USB-B Conector Source: www.cypressindustries.com; OC_FARNELL: unknown; OC_NEWARK: unknown
VREG12 = LM3671MF:LM3671MF-1.2: IC BUCK SYNC 1.2V 0.6A; MPN: LM3671MF-1.2; OC_FARNELL: 1685653; OC_NEWARK: 41K4937; PACKAGE: 5-SOT-23; SUPPLIER: NationalSemiconductor
VREG25 = MCP1603:MCP1603T-250I/OS: 2.0 MHz, 500 mA Synchronous Buck Regulator; MPN: MCP1603T-250I/OS; OC_FARNELL: 1834886; OC_NEWARK: 84R5174; PACKAGE: SOT23-5; SUPPLIER: Microchip
VREG33 = MCP1603:MCP1603T-330I/OS: 2.0 MHz, 500 mA Synchronous Buck Regulator; MPN: MCP1603T-330I/OS; OC_FARNELL: 1439373; OC_NEWARK: 22K1332; PACKAGE: SOT23-5; SUPPLIER: Microchip